# Altium project WM Mainboard.PrjPcb (part 1 of 2)
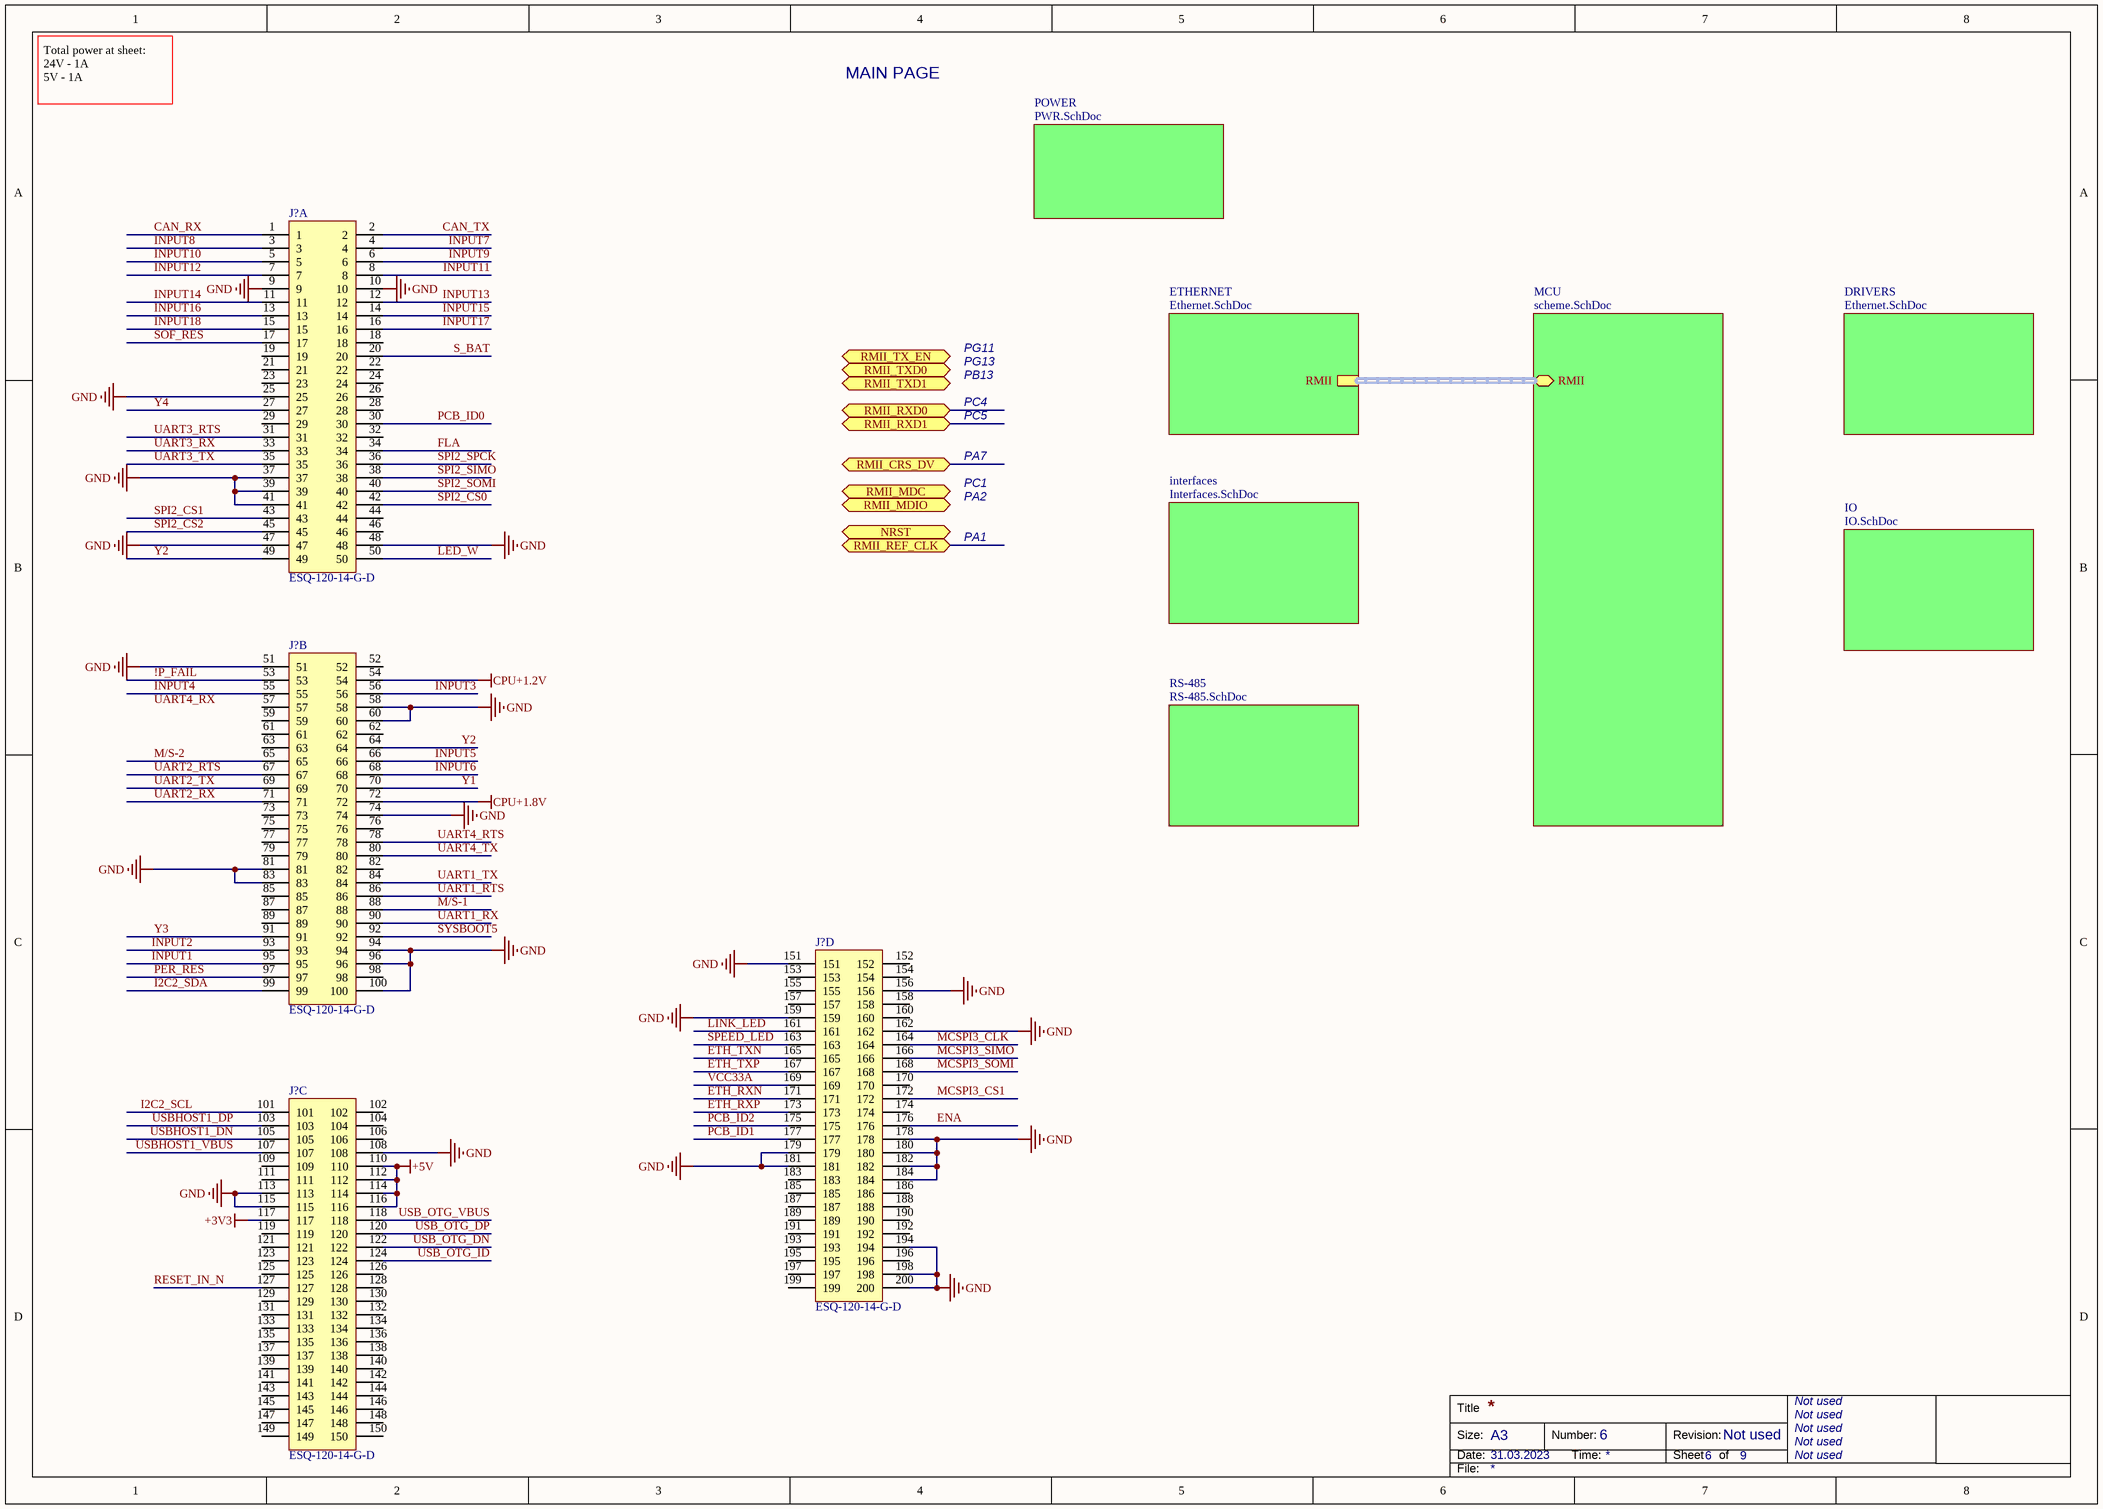
[diagram p0: WMM 05 Main Scheme.SchDoc]
CurrentDate: 31.03.2023; Project: Winding Machine Mainboard; Revision: 1.0; VersionRevision: 1.0
11 sheets, 177 parts. Net scope: hierarchical (ports join the sheet entries above them; power ports are global).
Board file: WMM Board.PcbDoc
Sheets:
  WMM 05 Main Scheme.SchDoc
    MCU = scheme.SchDoc
    IO = IO.SchDoc
      RELAYS = RELAYS.SchDoc
    POWER = PWR.SchDoc
    interfaces = Interfaces.SchDoc
    RS-485 = RS-485.SchDoc
  WMM 01 Cover Page.SchDoc
    Designator = WMM 02 Block Diagram.SchDoc
    Designator = WMM 02 Block Diagram.SchDoc
    Designator = WMM 03 PWR Diagram.SchDoc
    Designator = WMM 04 Insulation Diagram.SchDoc

## Sheet WMM 05 Main Scheme.SchDoc
size A3; Date: Not used; ApprovedBy: Not used; CheckedBy: Not used; Author: Not used; CompanyName: VR; DrawnBy: Not used; Engineer: Not used; Organization: Not used; Address1: Not used; Address2: Not used; Address3: Not used; Address4: Not used; DocumentNumber: 6; Revision: Not used; SheetNumber: 6; SheetTotal: 9; Time: Not used; ImagePath: Not used; Application_BuildNumber: Not used

### Parts
(Parts that share a designator on the sheet are numbered #1, #2 ... from top to bottom, then left to right.)
J?#1  ESQ-120-14-G-D  [SODIMM_200]  (part A of 4)
J?#2  ESQ-120-14-G-D  [SODIMM_200]  (part B of 4)
J?#3  ESQ-120-14-G-D  [SODIMM_200]  (part D of 4)
J?#4  ESQ-120-14-G-D  [SODIMM_200]  (part C of 4)

### Sub-sheets
DRIVERS = Ethernet.SchDoc (file not in this document): no entries
ETHERNET = Ethernet.SchDoc (file not in this document): RMII
interfaces = Interfaces.SchDoc: no entries
IO = IO.SchDoc: no entries
MCU = scheme.SchDoc: RMII (bidir)
POWER = PWR.SchDoc: no entries
RS-485 = RS-485.SchDoc: no entries

### Ports
NRST (bidir), RMII_CRS_DV (bidir), RMII_MDC (bidir), RMII_MDIO (bidir), RMII_REF_CLK (bidir), RMII_RXD0 (bidir), RMII_RXD1 (bidir), RMII_TX_EN (bidir), RMII_TXD0 (bidir), RMII_TXD1 (bidir)

### Nets
+3V3: J?#4.117
+5V: J?#4.110 J?#4.112 J?#4.114 J?#4.116
CPU+1.2V: J?#2.54
CPU+1.8V: J?#2.72
GND: J?#1.9 J?#1.10 J?#1.25 J?#1.37 J?#1.39 J?#1.41 J?#1.47 J?#1.48 J?#2.51 J?#2.58 J?#2.60 J?#2.74 J?#2.81 J?#2.83 J?#2.94 J?#2.96 J?#2.100 J?#3.151 J?#3.156 J?#3.159 J?#3.162 J?#3.178 J?#3.179 J?#3.180 J?#3.181 J?#3.182 J?#3.184 J?#3.194 J?#3.198 J?#3.200 J?#4.108 J?#4.113 J?#4.115
!P_FAIL: J?#2.53
CAN_RX: J?#1.1
CAN_TX: J?#1.2
ENA: J?#3.176
ETH_RXN: J?#3.171
ETH_RXP: J?#3.173
ETH_TXN: J?#3.165
ETH_TXP: J?#3.167
FLA: J?#1.34
I2C2_SCL: J?#4.101
I2C2_SDA: J?#2.99
INPUT1: J?#2.95
INPUT2: J?#2.93
INPUT3: J?#2.56
INPUT4: J?#2.55
INPUT5: J?#2.66
INPUT6: J?#2.68
INPUT7: J?#1.4
INPUT8: J?#1.3
INPUT9: J?#1.6
INPUT10: J?#1.5
INPUT11: J?#1.8
INPUT12: J?#1.7
INPUT13: J?#1.12
INPUT14: J?#1.11
INPUT15: J?#1.14
INPUT16: J?#1.13
INPUT17: J?#1.16
INPUT18: J?#1.15
LED_W: J?#1.50
LINK_LED: J?#3.161
M/S-1: J?#2.88
M/S-2: J?#2.65
MCSPI3_CLK: J?#3.164
MCSPI3_CS1: J?#3.172
MCSPI3_SIMO: J?#3.166
MCSPI3_SOMI: J?#3.168
PCB_ID0: J?#1.30
PCB_ID1: J?#3.177
PCB_ID2: J?#3.175
PER_RES: J?#2.97
RESET_IN_N: J?#4.127
S_BAT: J?#1.20
SOF_RES: J?#1.17
SPEED_LED: J?#3.163
SPI2_CS0: J?#1.42
SPI2_CS1: J?#1.43
SPI2_CS2: J?#1.45
SPI2_SIMO: J?#1.38
SPI2_SOMI: J?#1.40
SPI2_SPCK: J?#1.36
SYSBOOT5: J?#2.92
UART1_RTS: J?#2.86
UART1_RX: J?#2.90
UART1_TX: J?#2.84
UART2_RTS: J?#2.67
UART2_RX: J?#2.71
UART2_TX: J?#2.69
UART3_RTS: J?#1.31
UART3_RX: J?#1.33
UART3_TX: J?#1.35
UART4_RTS: J?#2.78
UART4_TX: J?#2.80
USB_OTG_DN: J?#4.122
USB_OTG_DP: J?#4.120
USB_OTG_ID: J?#4.124
USB_OTG_VBUS: J?#4.118
USBHOST1_DN: J?#4.105
USBHOST1_DP: J?#4.103
USBHOST1_VBUS: J?#4.107
VCC33A: J?#3.169
Y1: J?#2.70
Y2: J?#1.49 J?#2.64
Y3: J?#2.91
Y4: J?#1.27

Not connected (* = marked no-connect by the designer): J?#1 18 19 21 22 23 24 26 28 29 32 44 46; J?#2 52 57 59 61 62 63 73 75 76 77 79 82 85 87 89 98; J?#3 152 153 154 155 157 158 160 170 174 183 185 186 187 188 189 190 191 192 193 195 196 197 199; J?#4 102 104 106 109 111 119 121 123 125 126 128 129 130 131 132 133 134 135 136 137 138 139 140 141 142 143 144 145 146 147 148 149 150

### Buses and harness runs
harness sheet ETHERNET/RMII = sheet MCU/RMII

### Notes on the sheet
- Total power at sheet:
  24V - 1A
  5V - 1A
- MAIN PAGE
- PG11
- PG13
- PB13
- PC4
- PC5
- PA7
- PC1
- PA2
- PA1
- Labels drawn without touching a wire or pin: UART4_RX
- Title
- Size:
- Date:
- A3
- Number:
- Time:
- Revision:
- Sheet
- of
- File:

### Library data of the parts
J?#1-J?#4 = SODIMM-SOCKET: CONN RCPT 40POS .100" DUAL GOLD; Manufacturer: TE Connectivity; Manufacturer Part Number: 1717254-4; Connector Type: Receptacle; Number of Positions: 200; Number of Positions Loaded: All; Pitch: 0.100" (2.54mm); .Creator: MM; Supplier 1: Digi-Key; RoHS: RoHS Compliant; Category: Connectors, Interconnects; Stock 1: 51; Pricing 1: 1=7.42, 10=6.864, 50=6.1586, 100=5.7505, 250=5.00852, 500=4.823, 1000=4.6375, 2500=4.452 (USD); Packaging: Tape & Reel; Contact Type: Female Socket; Number of Rows: 2; Row Spacing: 0.100" (2.54mm); Mounting Type: Through Hole; Termination: Solder; Fastening Type: -; Features: -; Contact Finish: Gold; Contact Finish Thickness: 20µin (0.51µm); Color: Black; ComponentLink1URL: https://www.te.com/usa-en/product-1717254-4.html; ComponentLink1Description: DataSheet; Supplier Part Number 1: SAM8767-ND; .Checked PCB: MM; .Checked SCH: MM

## Sheet scheme.SchDoc: Driver Board For CNC
size A2; Author: veres; CompanyName: VR; DrawnBy: Vladimir; Engineer: Vladimir; Organization: Vladimir Tyrkin; Address1: veres.pcb@gmail.com; DocumentNumber: 001; Revision: 2.0; SheetNumber: 1; SheetTotal: 1
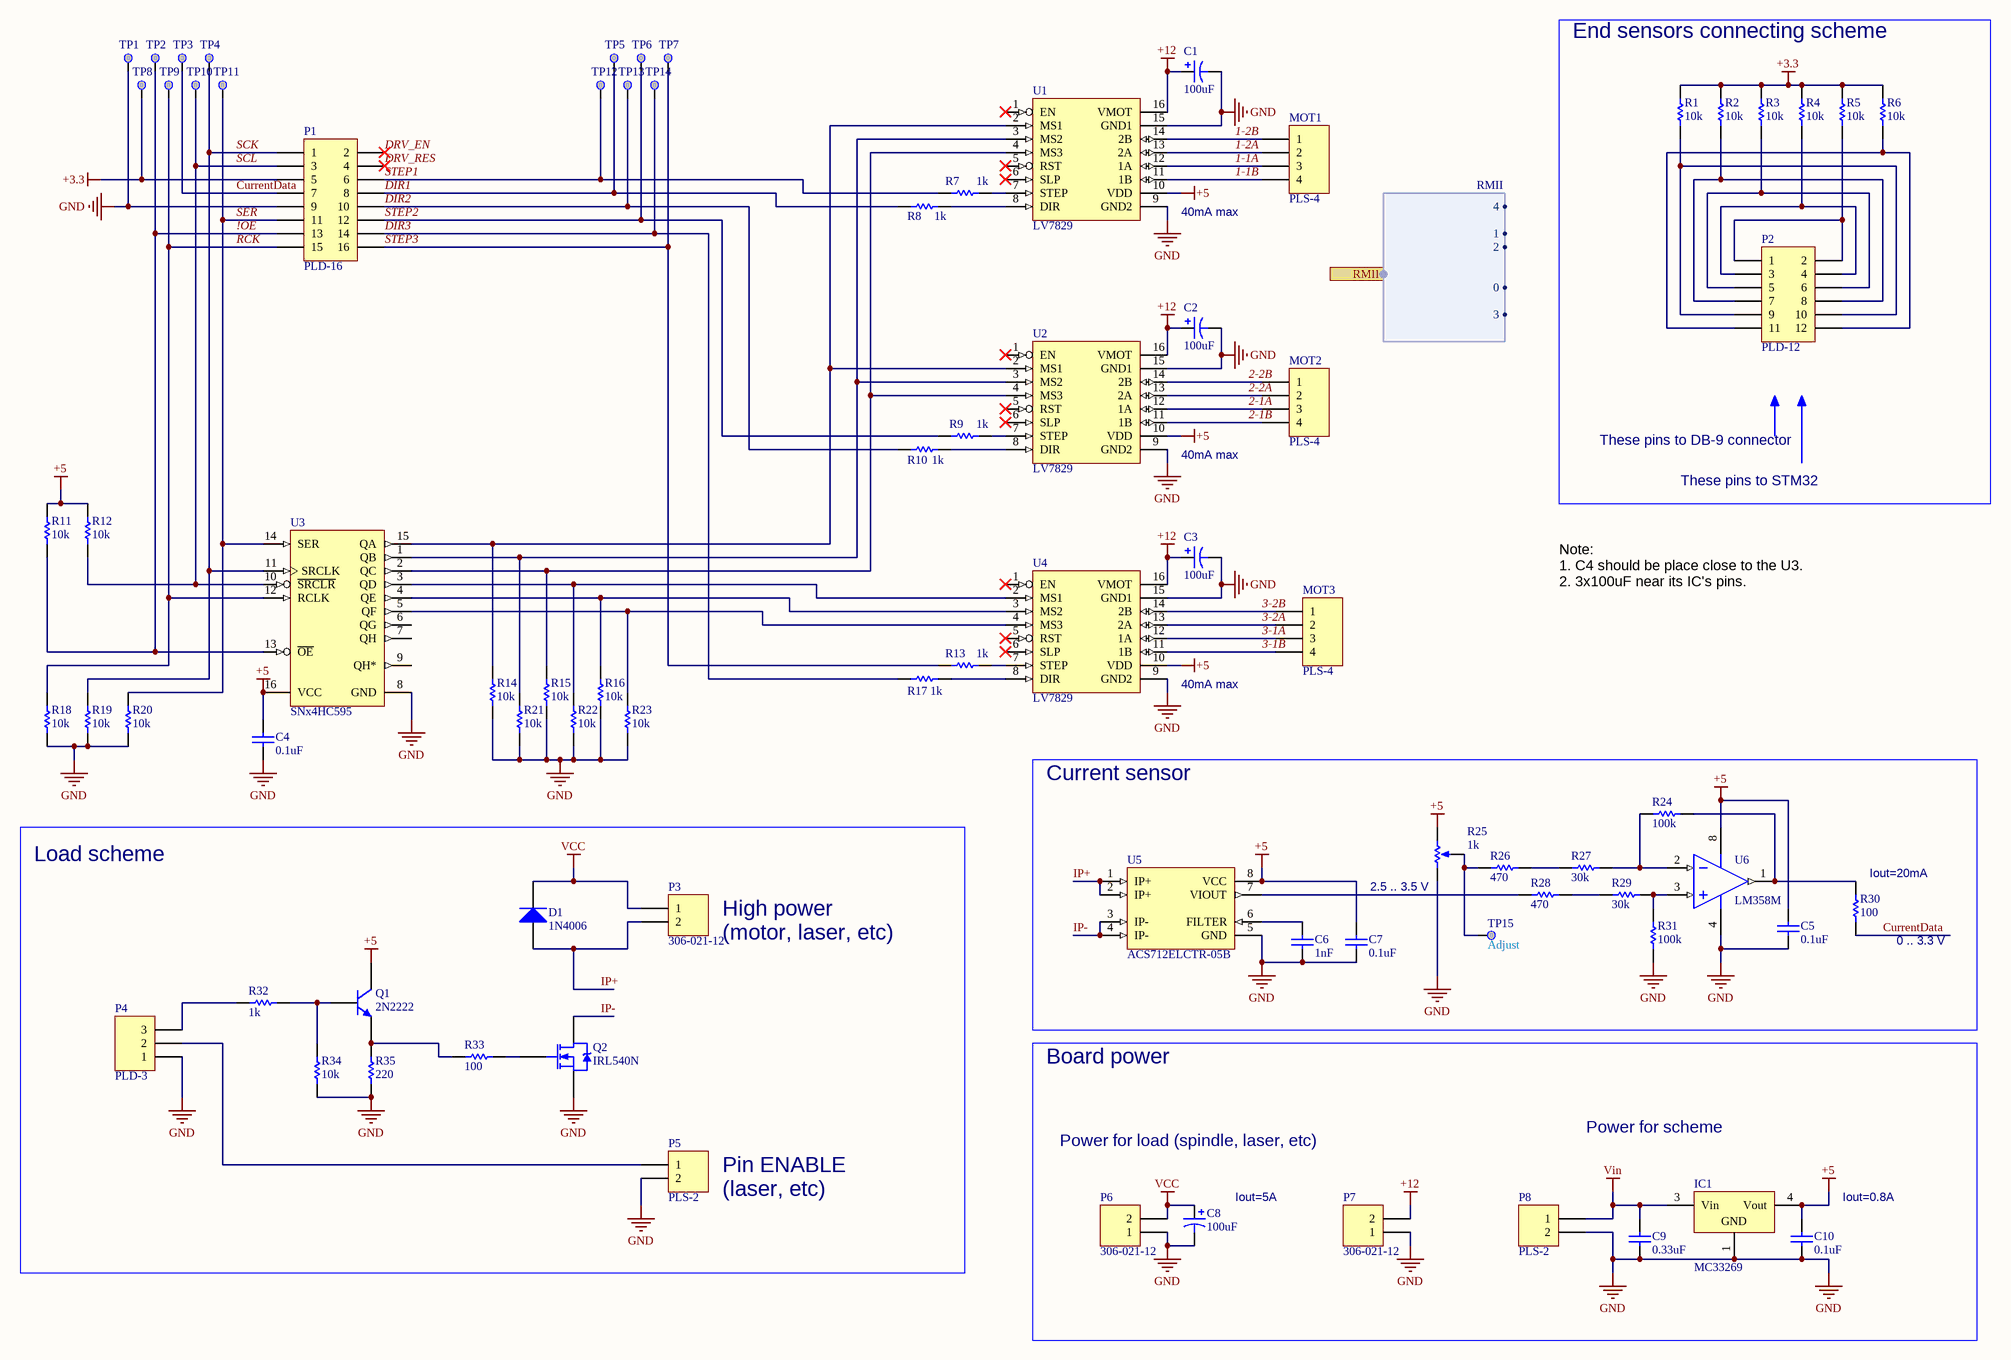
[diagram p1: scheme.SchDoc]

### Parts
C1  value 100uF  [UD-6,3X5,8_NICHICON]  (hidden comment: Cap Pol)
C2  value 100uF  [UD-6,3X5,8_NICHICON]  (hidden comment: Cap Pol)
C3  value 100uF  [UD-6,3X5,8_NICHICON]  (hidden comment: Cap Pol)
C4  value 0.1uF  [C1206]  (hidden comment: Cap)
C5  value 0.1uF  [C1206]  (hidden comment: Cap)
C6  value 1nF  [C0805]  (hidden comment: Cap)
C7  value 0.1uF  [C1206]  (hidden comment: Cap)
C8  value 100uF  [UD-6,3X5,8_NICHICON]  (hidden comment: Cap Pol)
C9  value 0.33uF  [C1206]  (hidden comment: Cap)
C10  value 0.1uF  [C1206]  (hidden comment: Cap)
D1  1N4006  [DO-41]
IC1  MC33269  [DPAK]
MOT1  PLS-4  [HDR1X4]
MOT2  PLS-4  [HDR1X4]
MOT3  PLS-4  [HDR1X4]
P1  PLD-16  [HDR2X8]
P2  PLD-12  [HDR2X6]
P3  306-021-12  [W237-102]
P4  PLD-3  [HDR1X3]
P5  PLS-2  [HDR1X2]
P6  306-021-12  [W237-102]
P7  306-021-12  [W237-102]
P8  PLS-2  [HDR1X2]
Q1  2N2222  [TO92]
Q2  IRL540N  [TO220BV]
R1  10k  [RES-0805]
R2  10k  [RES-0805]
R3  10k  [RES-0805]
R4  10k  [RES-0805]
R5  10k  [RES-0805]
R6  10k  [RES-0805]
R7  1k  [RES-0805]
R8  1k  [RES-0805]
R9  1k  [RES-0805]
R10  1k  [RES-0805]
R11  10k  [RES-0805]
R12  10k  [RES-0805]
R13  1k  [RES-0805]
R14  10k  [RES-0805]
R15  10k  [RES-0805]
R16  10k  [RES-0805]
R17  1k  [RES-0805]
R18  10k  [RES-0805]
R19  10k  [RES-0805]
R20  10k  [RES-0805]
R21  10k  [RES-0805]
R22  10k  [RES-0805]
R23  10k  [RES-0805]
R24  100k  [RES-0805]
R25  1k  [VR5]
R26  470  [RES-0805]
R27  30k  [RES-0805]
R28  470  [RES-1206]
R29  30k  [RES-0805]
R30  100  [RES-0805]
R31  100k  [RES-0805]
R32  1k  [RES-0805]
R33  100  [RES-0805]
R34  10k  [RES-0805]
R35  220  [RES-0805]
TP1  (no value)  [TP_SMD_1MM]  (no BOM)
TP2  (no value)  [TP_SMD_1MM]  (no BOM)
TP3  (no value)  [TP_SMD_1MM]  (no BOM)
TP4  (no value)  [TP_SMD_1MM]  (no BOM)
TP5  (no value)  [TP_SMD_1MM]  (no BOM)
TP6  (no value)  [TP_SMD_1MM]  (no BOM)
TP7  (no value)  [TP_SMD_1MM]  (no BOM)
TP8  (no value)  [TP_SMD_1MM]  (no BOM)
TP9  (no value)  [TP_SMD_1MM]  (no BOM)
TP10  (no value)  [TP_SMD_1MM]  (no BOM)
TP11  (no value)  [TP_SMD_1MM]  (no BOM)
TP12  (no value)  [TP_SMD_1MM]  (no BOM)
TP13  (no value)  [TP_SMD_1MM]  (no BOM)
TP14  (no value)  [TP_SMD_1MM]  (no BOM)
TP15  Adjust  [TestPoint]  (no BOM)
U1  LV7829  [LV8729_BREAKOUT]
U2  LV7829  [LV8729_BREAKOUT]
U3  SNx4HC595  [SO16]
U4  LV7829  [LV8729_BREAKOUT]
U5  value ACS712ELCTR-05B  [SO-8_L]  (hidden comment: Current Sensor)
U6  LM358M  [SO-8_L]

### Blocks framed on the sheet
End sensors connecting scheme: P2 R1-R6
Current sensor: C5-C7 R24-R31 TP15 U5 U6
Load scheme: D1 P3-P5 Q1 Q2 R32-R35
Board power: C8-C10 IC1 P6-P8

### Ports
RMII (harness RMII)

### Harnesses
RMII: 0, 1, 2, 3, 4

### Nets
+3.3: P1.5 R1.1 R2.1 R3.1 R4.1 R5.1 R6.1 TP8.1
+5: C4.2 C5.1 C7.2 C10.2 IC1.4(Vout) Q1.1(C) R11.1 R12.1 R25.3(BOT) U1.10(VDD) U2.10(VDD) U3.16(VCC) U4.10(VDD) U5.8(VCC) U6.8(V+)
+12: C1.1 C2.1 C3.1 P7.2 U1.16(VMOT) U2.16(VMOT) U4.16(VMOT)
GND: C1.2 C2.2 C3.2 C4.1 C5.2 C6.1 C7.1 C8.2 C9.1 C10.1 IC1.1(GND) P1.9 P4.1 P5.2 P6.1 P7.1 P8.2 Q2.3(S) R14.2 R15.2 R16.2 R18.2 R19.2 R20.2 R21.2 R22.2 R23.2 R25.1(TOP) R31.2 R34.2 R35.2 TP1.1 U1.9(GND2) U1.15(GND1) U2.9(GND2) U2.15(GND1) U3.8(GND) U4.9(GND2) U4.15(GND1) U5.5(GND) U6.4(V-)
VCC: C8.1 D1.2(K) P3.1 P6.2
Vin: C9.2 IC1.3(Vin) P8.1
1-1A: MOT1.3 U1.12(1A)
1-1B: MOT1.4 U1.11(1B)
1-2A: MOT1.2 U1.13(2A)
1-2B: MOT1.1 U1.14(2B)
2-1A: MOT2.3 U2.12(1A)
2-1B: MOT2.4 U2.11(1B)
2-2A: MOT2.2 U2.13(2A)
2-2B: MOT2.1 U2.14(2B)
3-1A: MOT3.3 U4.12(1A)
3-1B: MOT3.4 U4.11(1B)
3-2A: MOT3.2 U4.13(2A)
3-2B: MOT3.1 U4.14(2B)
!OE: P1.13 R11.2 TP2.1 U3.13(~{OE})
CurrentData: P1.7 R30.2 TP3.1
DIR1: P1.8 R8.2 TP5.1
DIR2: P1.10 R10.2 TP13.1
DIR3: P1.14 R17.2 TP14.1
DRV_EN: P1.2
DRV_RES: P1.4
IP+: D1.1(A) P3.2 U5.1(IP+) U5.2(IP+)
IP-: Q2.2(D) U5.3(IP-) U5.4(IP-)
RCK: P1.15 R18.1 TP9.1 U3.12(RCLK)
SCK: P1.1 R19.1 TP4.1 U3.11(SRCLK)
SCL: P1.3 R12.2 TP10.1 U3.10(~{SRCLR})
SER: P1.11 R20.1 TP11.1 U3.14(SER)
STEP1: P1.6 R7.2 TP12.1
STEP2: P1.12 R9.2 TP6.1
STEP3: P1.16 R13.2 TP7.1
NetC6_2: C6.2 U5.6(FILTER)
NetP2_1: P2.1 P2.2 R5.2
NetP2_3: P2.3 P2.4 R4.2
NetP2_5: P2.5 P2.6 R3.2
NetP2_7: P2.7 P2.8 R2.2
NetP2_9: P2.9 P2.10 R1.2
NetP2_11: P2.11 P2.12 R6.2
NetP4_2: P4.2 P5.1
NetP4_3: P4.3 R32.2
NetQ1_2: Q1.2(B) R32.1 R34.1
NetQ1_3: Q1.3(E) R33.2 R35.1
NetQ2_1: Q2.1(G) R33.1
NetR7_1: R7.1 U1.7(STEP)
NetR8_1: R8.1 U1.8(DIR)
NetR9_1: R9.1 U2.7(STEP)
NetR10_1: R10.1 U2.8(DIR)
NetR13_1: R13.1 U4.7(STEP)
NetR14_1: R14.1 U1.2(MS1) U2.2(MS1) U3.15(QA)
NetR15_1: R15.1 U1.4(MS3) U2.4(MS3) U3.2(QC)
NetR16_1: R16.1 U3.4(QE) U4.3(MS2)
NetR17_1: R17.1 U4.8(DIR)
NetR21_1: R21.1 U1.3(MS2) U2.3(MS2) U3.1(QB)
NetR22_1: R22.1 U3.3(QD) U4.2(MS1)
NetR23_1: R23.1 U3.5(QF) U4.4(MS3)
NetR24_1: R24.1 R27.1 U6.2(IN-)
NetR24_2: R24.2 R30.1 U6.1(OUT)
NetR25_2: R25.2(TAP) R26.1 TP15.1
NetR26_2: R26.2 R27.2
NetR28_1: R28.1 U5.7(VIOUT)
NetR28_2: R28.2 R29.2
NetR29_1: R29.1 R31.1 U6.3(IN+)

Not connected (* = marked no-connect by the designer): U1 1(EN)* 5(RST)* 6(SLP)*; U2 1(EN)* 5(RST)* 6(SLP)*; U3 6(QG) 7(QH) 9(QH*); U4 1(EN)* 5(RST)* 6(SLP)*

### Notes on the sheet
- (near U1) 40mA max
- (near U2) 40mA max
- These pins to DB-9 connector
- These pins to STM32
- (near U4) 40mA max
- Note:
  1. C4 should be place close to the U3.
  2. 3x100uF near its IC's pins.
- (near R25) 2.5 .. 3.5 V
- (near R30) Iout=20mA
- High power
  (motor, laser, etc)
- (near R30) 0 .. 3.3 V
- Power for load (spindle, laser, etc)
- Power for scheme
- Pin ENABLE
  (laser, etc)
- (near C8) Iout=5A
- Iout=0.8A
- Title
- Size:
- Date:
- File:
- A2
- Number:
- Time:
- Revision:
- Sheet
- of

### Library data of the parts
C1-C3 C8 = Cap Pol1: Polarized Capacitor (Radial) 16V, 105°C, 20% 6.3x5.4mm; Manufacturer: JB; Manufacturer_Part_Number: JCL1C101M063054; CHIPIDIP-code: 9000565735
C4 C5 C7 C10 = Cap: Capacitor ceramic SMD; Manufacturer: Murata; Manufacturer_Part_Number: GRM319R71H104K; CHIPIDIP-code: 348319975; Part_Type: Capacitor
C6 = Cap: Capacitor ceramic SMD; Manufacturer: HOLYSTONECAPS; Manufacturer_Part_Number: MLCC1000pFX7R50V10%0805; CHIPIDIP-code: 40582; Part_Type: Capacitor
C9 = Cap: Capacitor ceramic SMD; Manufacturer: Murata; Manufacturer_Part_Number: GRM319R71H334KA01D; CHIPIDIP-code: 344025606; Part_Type: Capacitor
D1 = Diode 1N4004: 1 Amp General Purpose Rectifier; Manufacturer: DC COMPONENTS CO., LTD.; Part_Type: Diode, Axial; CHIPIDIP-code: 3519; ComponentLink1Description: Manufacturer Link; ComponentLink1URL: http://www.fairchildsemi.com/; ComponentLink2Description: Datasheet; ComponentLink2URL: http://www.fairchildsemi.com/ds/1N%2F1N4001.pdf; Value: 1N4006; Manufacturer_Part_Number: 1N4006
IC1 = Volt Reg 5V: 5V Voltage Regulator; Manufacturer_Part_Number: MC33269DT−5.0; Manufacturer: ON Semiconductor; CHIPIDIP-code: 563066499; Value: MC33269; Part_Type: Voltage regulator
MOT1-MOT3 = Header 4: Header, 4-Pin; Manufacturer: Connfly; Manufacturer_Part_Number: DS1021-1*4SF11-B; Part_Type: Connector; CHIPIDIP-code: 174993133; Value2: (DS1021-1x4); Value: PLS-4
P1 = Header 8X2: Header, 8-Pin, Dual row; Manufacturer: Connfly; Manufacturer_Part_Number: DS1021-2*8SF11-B; Part_Type: Connector; CHIPIDIP-code: 4114; Value2: (DS1021-2x8); Value: PLD-16
P2 = Header 6X2: Header, 6-Pin, Dual row; Manufacturer: Connfly; Manufacturer_Part_Number: DS1021-2*6SF11-B; Part_Type: Connector; CHIPIDIP-code: none; Value2: DS1021-2x6; Value: PLD-12
P3 P6 P7 = Header 2: Screw connector, 2-Pin; Manufacturer: Ningbo Xinya M&E; Manufacturer_Part_Number: XY306A-5.0-2P-12; CHIPIDIP-code: 43112; Part_Type: Connector; Value: 306-021-12
P4 = Header 3: Header, 3-Pin; Manufacturer: Connfly; Manufacturer_Part_Number: DS1021-1*3SF11-B; Part_Type: Connector; CHIPIDIP-code: 132511368; Value2: (DS1021-1x3); Value: PLD-3
P5 P8 = Header 2: Header, 2-Pin; Manufacturer: Connfly; Manufacturer_Part_Number: DS1021-1*2SF11-B; Part_Type: Connector; CHIPIDIP-code: 260750144; Value2: (DS1021-1x2); Value: PLS-2
Q1 = NPN: NPN Bipolar Transistor; Manufacturer: ON Semiconductor; Manufacturer_Part_Number: KSP2222ABU; CHIPIDIP-code: 363567003; Value: 2N2222; Part_Type: Transistor
Q2 = NMOS-2: N-Channel Power MOSFET; Manufacturer: Infineon Technologies; Part_Type: Transistor; Manufacturer_Part_Number: IRL540NPBF; CHIPIDIP-code: 387859736; ComponentLink1Description: Manufacturer Link; ComponentLink1URL: http://www.irf.com/; Value: IRL540N
R1-R6 R11 R12 R14-R16 R18-R23 R34 = Res: Rectangular Thick Film Chip Resistor; Manufacturer_Part_Number: RC0805FR-0710KL; Manufacturer: Yageo; CHIPIDIP-code: 9000079514; Note: If flow soldering, adjust pad width of PCB Footprint to 0.7 - 0.8 times the width of the resistor.; Part_Type: Resistor; ComponentLink1Description: Manufacturer Link; ComponentLink1URL: http://www.panasonic.com/industrial/components/resistive_products.htm; ComponentLink2Description: Datasheet; ComponentLink2URL: http://www.panasonic.com/industrial/components/pdf/AOA0000CE8.pdf; Value: 10k
R7-R10 R13 R17 R32 = Res: Rectangular Thick Film Chip Resistor; Manufacturer: Yageo; Manufacturer_Part_Number: RC0805FR-071KL; CHIPIDIP-code: 9000079486; Note: If flow soldering, adjust pad width of PCB Footprint to 0.7 - 0.8 times the width of the resistor.; Part_Type: Resistor; ComponentLink1Description: Manufacturer Link; ComponentLink1URL: http://www.panasonic.com/industrial/components/resistive_products.htm; ComponentLink2Description: Datasheet; ComponentLink2URL: http://www.panasonic.com/industrial/components/pdf/AOA0000CE8.pdf; Value: 1k
R24 R31 = Res: Rectangular Thick Film Chip Resistor; Manufacturer_Part_Number: RC0805FR-07100KL; Manufacturer: Yageo; Note: If flow soldering, adjust pad width of PCB Footprint to 0.7 - 0.8 times the width of the resistor.; CHIPIDIP-code: 9000079538; ComponentLink1Description: Manufacturer Link; ComponentLink1URL: http://www.panasonic.com/industrial/components/resistive_products.htm; ComponentLink2Description: Datasheet; ComponentLink2URL: http://www.panasonic.com/industrial/components/pdf/AOA0000CE8.pdf; Value: 100k; Part_Type: Resistor
R25 = RPot: Potentiometer; Manufacturer_Part_Number: 3296W-1-102LF; Manufacturer: Bourns; CHIPIDIP-code: 4464; Set Position: 0.5; Part_Type: Potentiometer; Value: 1k
R26 = Res: Rectangular Thick Film Chip Resistor; Manufacturer_Part_Number: RC0805FR-07470RL; Manufacturer: Yageo; CHIPIDIP-code: 9000079478; Note: If flow soldering, adjust pad width of PCB Footprint to 0.7 - 0.8 times the width of the resistor.; Part_Type: Resistor; ComponentLink1Description: Manufacturer Link; ComponentLink1URL: http://www.panasonic.com/industrial/components/resistive_products.htm; ComponentLink2Description: Datasheet; ComponentLink2URL: http://www.panasonic.com/industrial/components/pdf/AOA0000CE8.pdf; Value: 470
R27 R29 = Res: Rectangular Thick Film Chip Resistor; Manufacturer_Part_Number: RC0805FR-0730KL; Manufacturer: Yageo; Note: If flow soldering, adjust pad width of PCB Footprint to 0.7 - 0.8 times the width of the resistor.; CHIPIDIP-code: 9000079525; ComponentLink1Description: Manufacturer Link; ComponentLink1URL: http://www.panasonic.com/industrial/components/resistive_products.htm; ComponentLink2Description: Datasheet; ComponentLink2URL: http://www.panasonic.com/industrial/components/pdf/AOA0000CE8.pdf; Value: 30k; Part_Type: Resistor
R28 = Res: Rectangular Thick Film Chip Resistor; Manufacturer_Part_Number: RC1206FR-07470RL; Manufacturer: Yageo; CHIPIDIP-code: 9000079907; Note: If flow soldering, adjust pad width of PCB Footprint to 0.7 - 0.8 times the width of the resistor.; Part_Type: Resistor; ComponentLink1Description: Manufacturer Link; ComponentLink1URL: http://www.panasonic.com/industrial/components/resistive_products.htm; ComponentLink2Description: Datasheet; ComponentLink2URL: http://www.panasonic.com/industrial/components/pdf/AOA0000CE8.pdf; Value: 470
R30 = Res: Rectangular Thick Film Chip Resistor; Manufacturer_Part_Number: RC0805FR-07100RL; Manufacturer: Yageo; Note: If flow soldering, adjust pad width of PCB Footprint to 0.7 - 0.8 times the width of the resistor.; CHIPIDIP-code: 9000079462; ComponentLink1Description: Manufacturer Link; ComponentLink1URL: http://www.panasonic.com/industrial/components/resistive_products.htm; ComponentLink2Description: Datasheet; ComponentLink2URL: http://www.panasonic.com/industrial/components/pdf/AOA0000CE8.pdf; Value: 100; Part_Type: Resistor
R33 = Res: Rectangular Thick Film Chip Resistor; Manufacturer_Part_Number: RC0805FR-07100RL; Manufacturer: Yageo; CHIPIDIP-code: 9000079462; Note: If flow soldering, adjust pad width of PCB Footprint to 0.7 - 0.8 times the width of the resistor.; Part_Type: Resistor; ComponentLink1Description: Manufacturer Link; ComponentLink1URL: http://www.panasonic.com/industrial/components/resistive_products.htm; ComponentLink2Description: Datasheet; ComponentLink2URL: http://www.panasonic.com/industrial/components/pdf/AOA0000CE8.pdf; Value: 100
R35 = Res: Rectangular Thick Film Chip Resistor; Manufacturer_Part_Number: RC0805FR-07220RL; Manufacturer: Yageo; CHIPIDIP-code: 9000079470; Note: If flow soldering, adjust pad width of PCB Footprint to 0.7 - 0.8 times the width of the resistor.; Part_Type: Resistor; ComponentLink1Description: Manufacturer Link; ComponentLink1URL: http://www.panasonic.com/industrial/components/resistive_products.htm; ComponentLink2Description: Datasheet; ComponentLink2URL: http://www.panasonic.com/industrial/components/pdf/AOA0000CE8.pdf; Value: 220
TP1-TP15 = Test Point: Part_Type: Mechanical; Status: Released; Manufacturer_Part_Number: n/a; Manufacturer: n/a; ComponentLink1Description: Datasheet; ComponentLink1URL: http://na
  TP15: Value: Adjust
U1 U2 U4 = LV7829: Stepper motor driver; Manufacturer_Part_Number: LV7829 Module; Manufacturer: China; CHIPIDIP-code: none; ComponentLink1Description: Datasheet; Part_Type: Driver; ComponentLink1URL: http://tunmcdsvn.tun.st.com/Component_Datasheet_Library/Trunk/Diodes/STM_ESD_ESDA6V1BC6; Value: LV7829; Component_Link: https://aliexpress.ru/item/32881945086.html?_ga=2.148448563.506267163.1640105170-654681520.1604340042&_gac=1.114864501.1639346332.Cj0KCQiA2NaNBhDvARIsAEw55hg0RpnmDiEVLwfBwV1DBwQRRzTZISLV43c0hEMg0tSMQHOqo776kiQaArGpEALw_wcB&sku_id=65626866361&spm=a2g39.orderlist.0.0.68c74aa6SGBVzg
  U1: ComponentLink: *
U3 = SNx4HC595: 8-bit shift register with 3-state output register; Manufacturer_Part_Number: SN74HC595D; Manufacturer: TI; CHIPIDIP-code: 37776; ComponentLink1Description: Datasheet; Part_Type: Shift register; ComponentLink1URL: http://tunmcdsvn.tun.st.com/Component_Datasheet_Library/Trunk/Diodes/STM_ESD_ESDA6V1BC6; Value: SNx4HC595
U5 = ACS712ELCTR-05B: Hall-Effect-Based Linear Current Sensor +-5A; Manufacturer: Allegro; CHIPIDIP-code: 9000043254; Manufacturer_Part_Number: ACS712ELCTR-05B; ComponentLink1Description: Datasheet; Part_Type: Sensor; ComponentLink1URL: http://tunmcdsvn.tun.st.com/Component_Datasheet_Library/Trunk/Diodes/STM_ESD_ESDA6V1BC6
U6 = Op Amp: FET Operational Amplifier; Manufacturer_Part_Number: LM358M/NOPB; Part_Type: OpAmp; Manufacturer: TI; CHIPIDIP-code: 39253; ComponentLink1Description: Manufacturer Link; ComponentLink1URL: http://www.analog.com/; Value: LM358M

## Sheet IO.SchDoc: Digital input and output
size A4; Date: Not used; ApprovedBy: Not used; CheckedBy: Not used; Author: Not used; CompanyName: STMicroelectronics; DrawnBy: Not used; Engineer: Not used; Organization: Not used; Address1: Not used; Address2: Not used; Address3: Not used; Address4: Not used; DocumentNumber: 6; Revision: Not used; SheetNumber: 6; SheetTotal: 9; Time: Not used; ImagePath: Not used; Application_BuildNumber: Not used
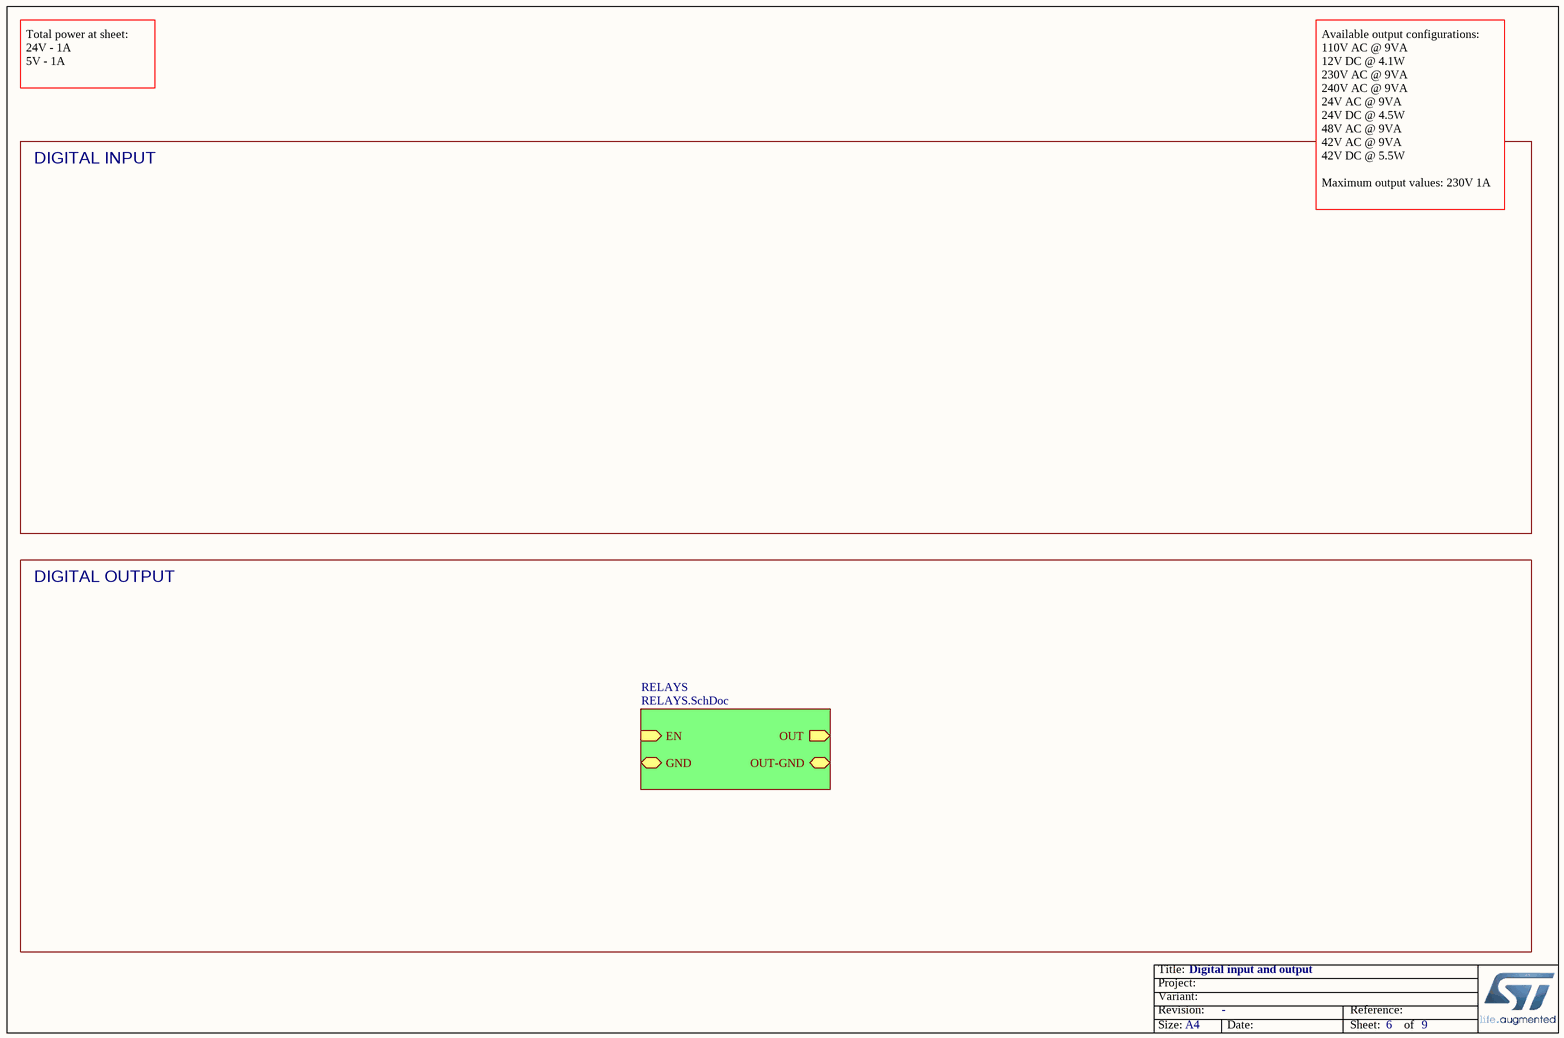
[diagram p2: IO.SchDoc]

### Sub-sheets
RELAYS = RELAYS.SchDoc: OUT (out), OUT-GND (bidir), EN (in), GND (bidir)

### Notes on the sheet
- Total power at sheet:
  24V - 1A
  5V - 1A
- DIGITAL INPUT
- Available output configurations:
  110V AC @ 9VA
  12V DC @ 4.1W
  230V AC @ 9VA
  240V AC @ 9VA
  24V AC @ 9VA
  24V DC @ 4.5W
  48V AC @ 9VA
  42V AC @ 9VA
  42V DC @ 5.5W
  Maximum output values: 230V 1A
- DIGITAL OUTPUT
- Title:
- Project:
- Size:
- Revision:
- Variant:
- A4
- -
- Date:
- Reference:
- Sheet:
- of

## Sheet RELAYS.SchDoc: Relays
size A4; Date: Not used; ApprovedBy: Not used; CheckedBy: Not used; Author: Not used; CompanyName: STMicroelectronics; DrawnBy: Not used; Engineer: Not used; Organization: Not used; Address1: Not used; Address2: Not used; Address3: Not used; Address4: Not used; DocumentNumber: 6; Revision: Not used; SheetNumber: 6; SheetTotal: 9; Time: Not used; ImagePath: Not used; Application_BuildNumber: Not used
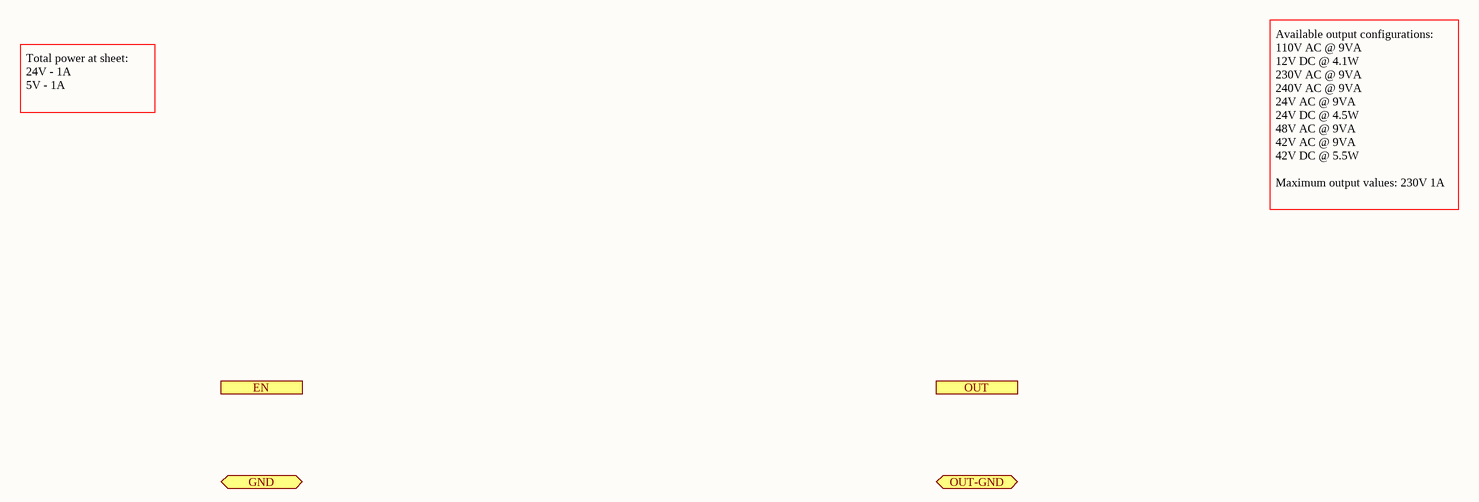
[diagram p3: RELAYS.SchDoc]

### Ports
EN (in), GND (bidir), OUT (out), OUT-GND (bidir)

### Notes on the sheet
- Total power at sheet:
  24V - 1A
  5V - 1A
- Available output configurations:
  110V AC @ 9VA
  12V DC @ 4.1W
  230V AC @ 9VA
  240V AC @ 9VA
  24V AC @ 9VA
  24V DC @ 4.5W
  48V AC @ 9VA
  42V AC @ 9VA
  42V DC @ 5.5W
  Maximum output values: 230V 1A
- Title
- Size:
- Date:
- A4
- Number:
- Time:
- Revision:
- Sheet
- of
- File:

## Sheet PWR.SchDoc
size A4; Organization: Altium Limited; Address1: L3, 12a Rodborough Rd; Address2: Frenchs Forest; Address3: NSW; Address4: Australia 2086
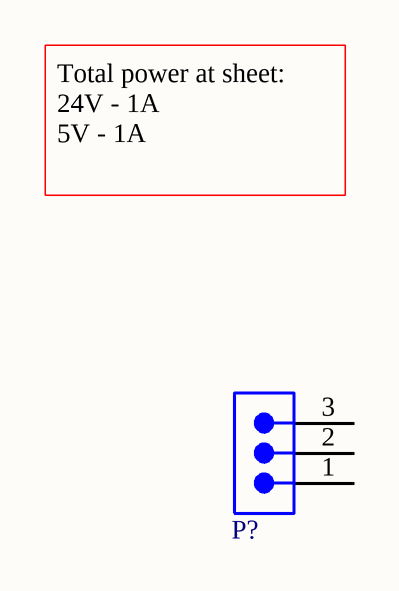
[diagram p4: PWR.SchDoc]

### Parts
P?  691313410003  [691313410003]  (value not drawn)

### Nets

Not connected (* = marked no-connect by the designer): P? 1 2 3

### Notes on the sheet
- Total power at sheet:
  24V - 1A
  5V - 1A
- Title
- Size:
- Date:
- A4
- Number:
- Time:
- Revision:
- Sheet
- of
- File:

### Library data of the parts
P? = 691313410003: WR-TBL Series 3134 Close Horizontal PCB Header, THT, pitch 7.62mm, 3p; Manufacturer: Wurth Elektronik; Modularity: No; Rated Current: 20A; Working Voltage: 300V; ComponentLink1Description: Website Link; ComponentLink1URL: https://www.we-online.com/redexpert/article/691313410003?ad; ComponentLink2Description: Datasheet Link; ComponentLink2URL: https://www.we-online.com/redexpert/spec/691313410003?ad; Manufacturer Part Number: 691313410003; Category: Terminal Blocks; Match Code: WR-TBL; Mount: Through Hole; Operating Temperature Max: 105°C; Operating Temperature Min: -40°C; Packaging: Box; Application: Pluggable; Number of Pins: 3; Number of Rows: 1; Orientation: Horizontal; Pitch: 7.62mm

## Sheet Interfaces.SchDoc: Ethernet PHY with RJ45 connector
size A2; Date: Not used; ApprovedBy: Not used; CheckedBy: Not used; Author: Not used; CompanyName: STMicroelectronics; DrawnBy: Not used; Engineer: Not used; Organization: Not used; Address1: Not used; Address2: Not used; Address3: Not used; Address4: Not used; DocumentNumber: 6; Revision: Not used; SheetNumber: 6; SheetTotal: 9; Time: Not used; ImagePath: Not used; Application_BuildNumber: Not used
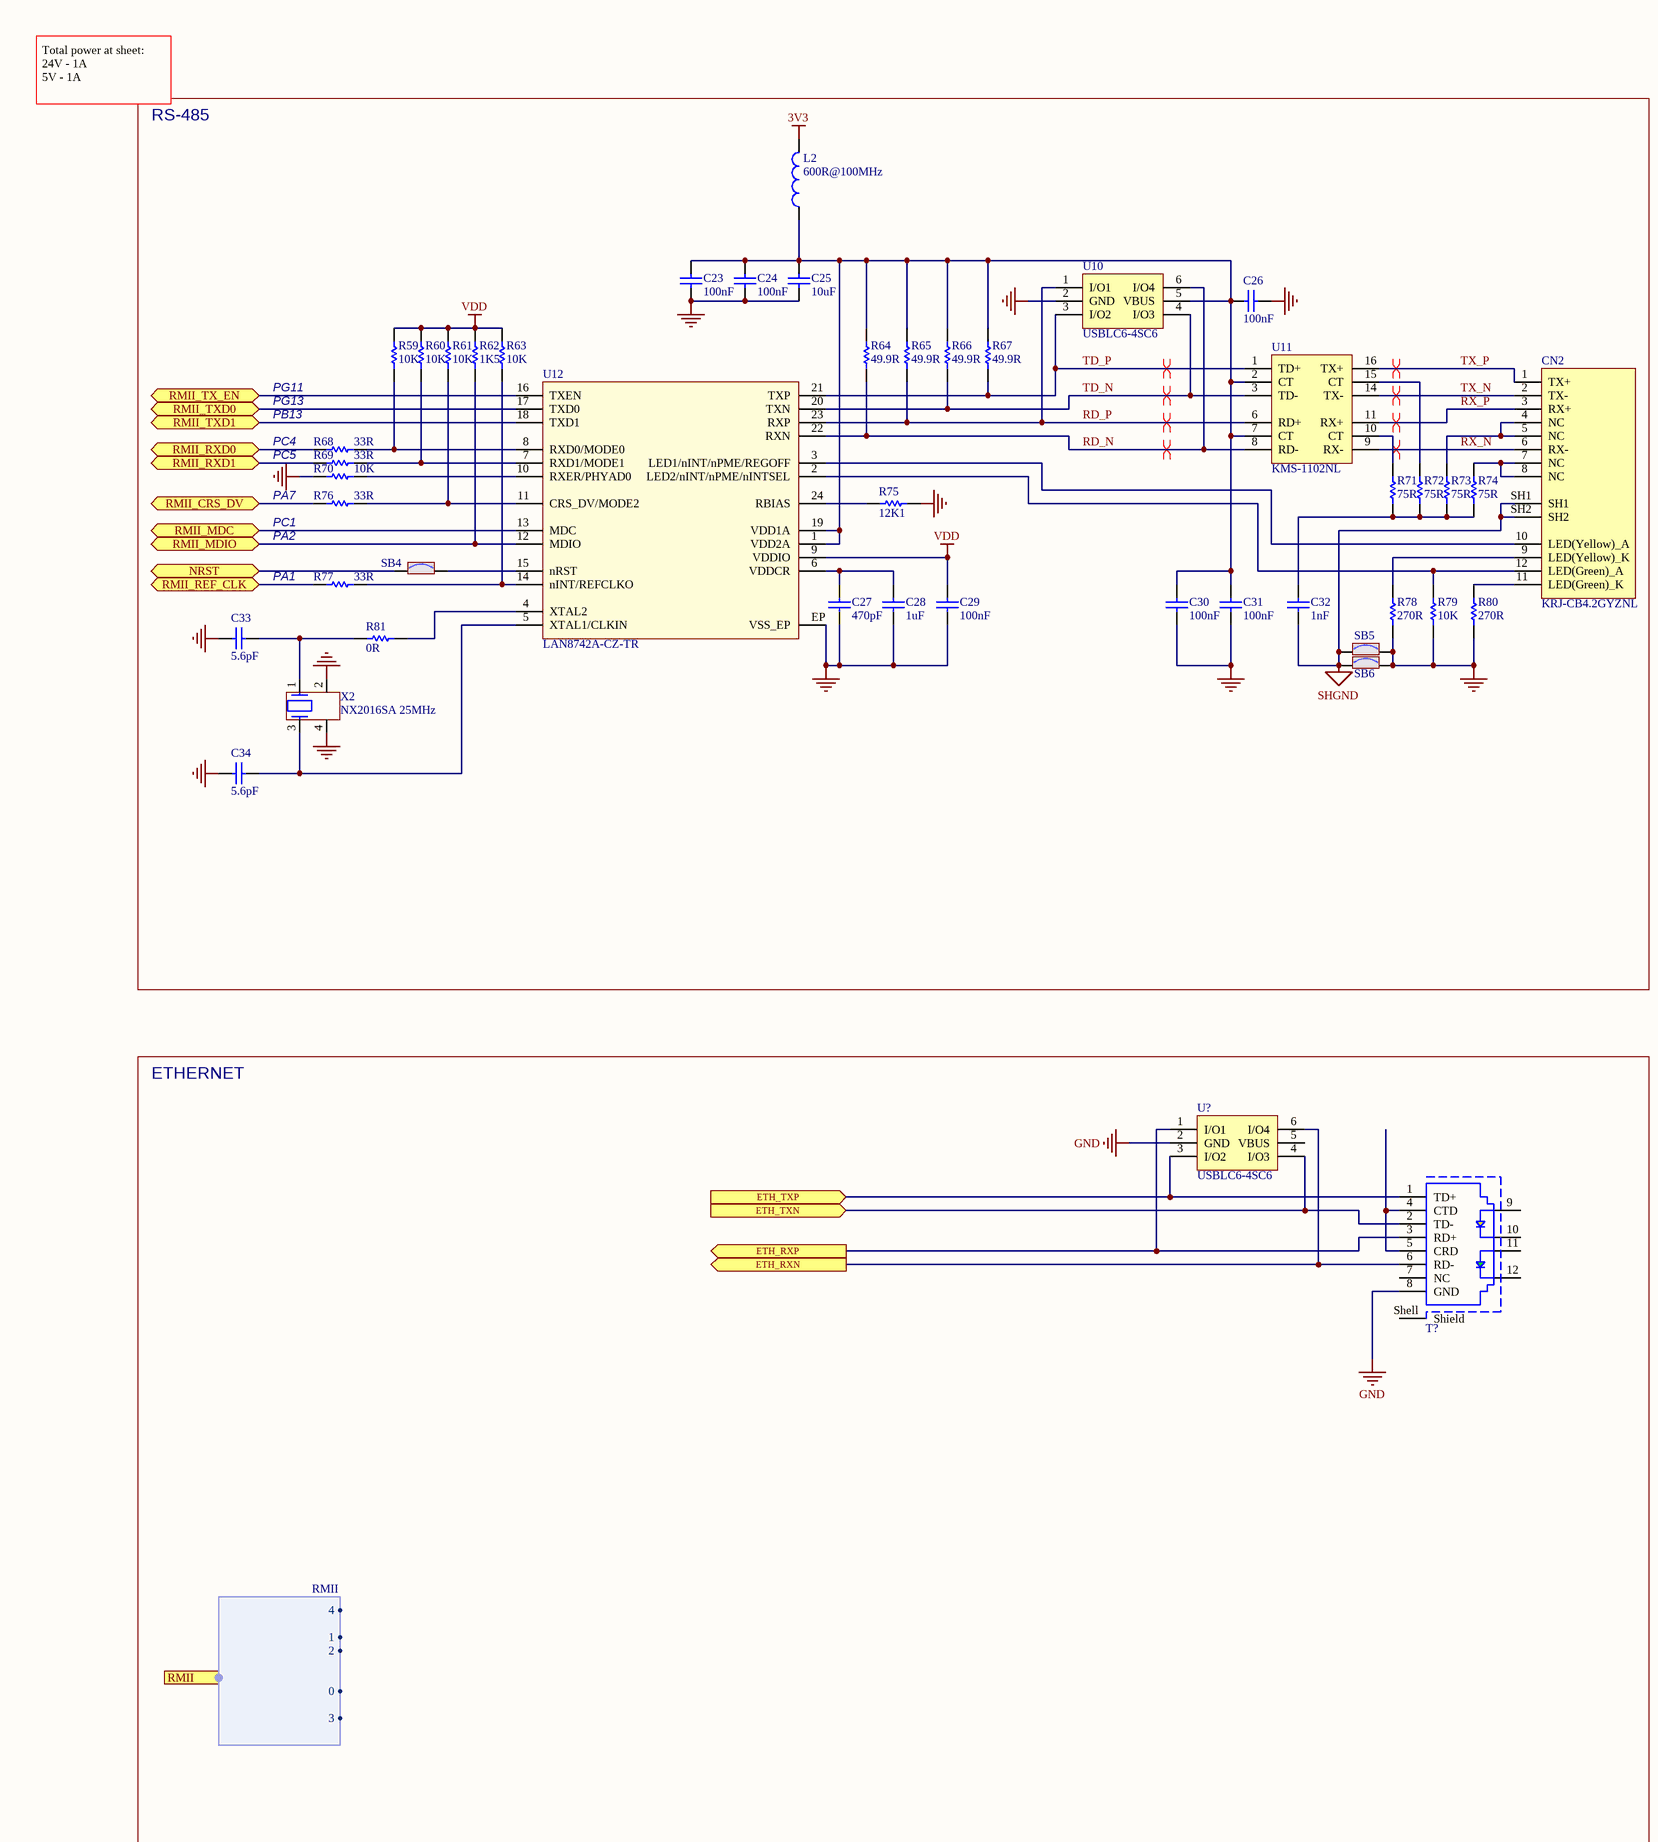
[diagram p5: Interfaces.SchDoc, left]
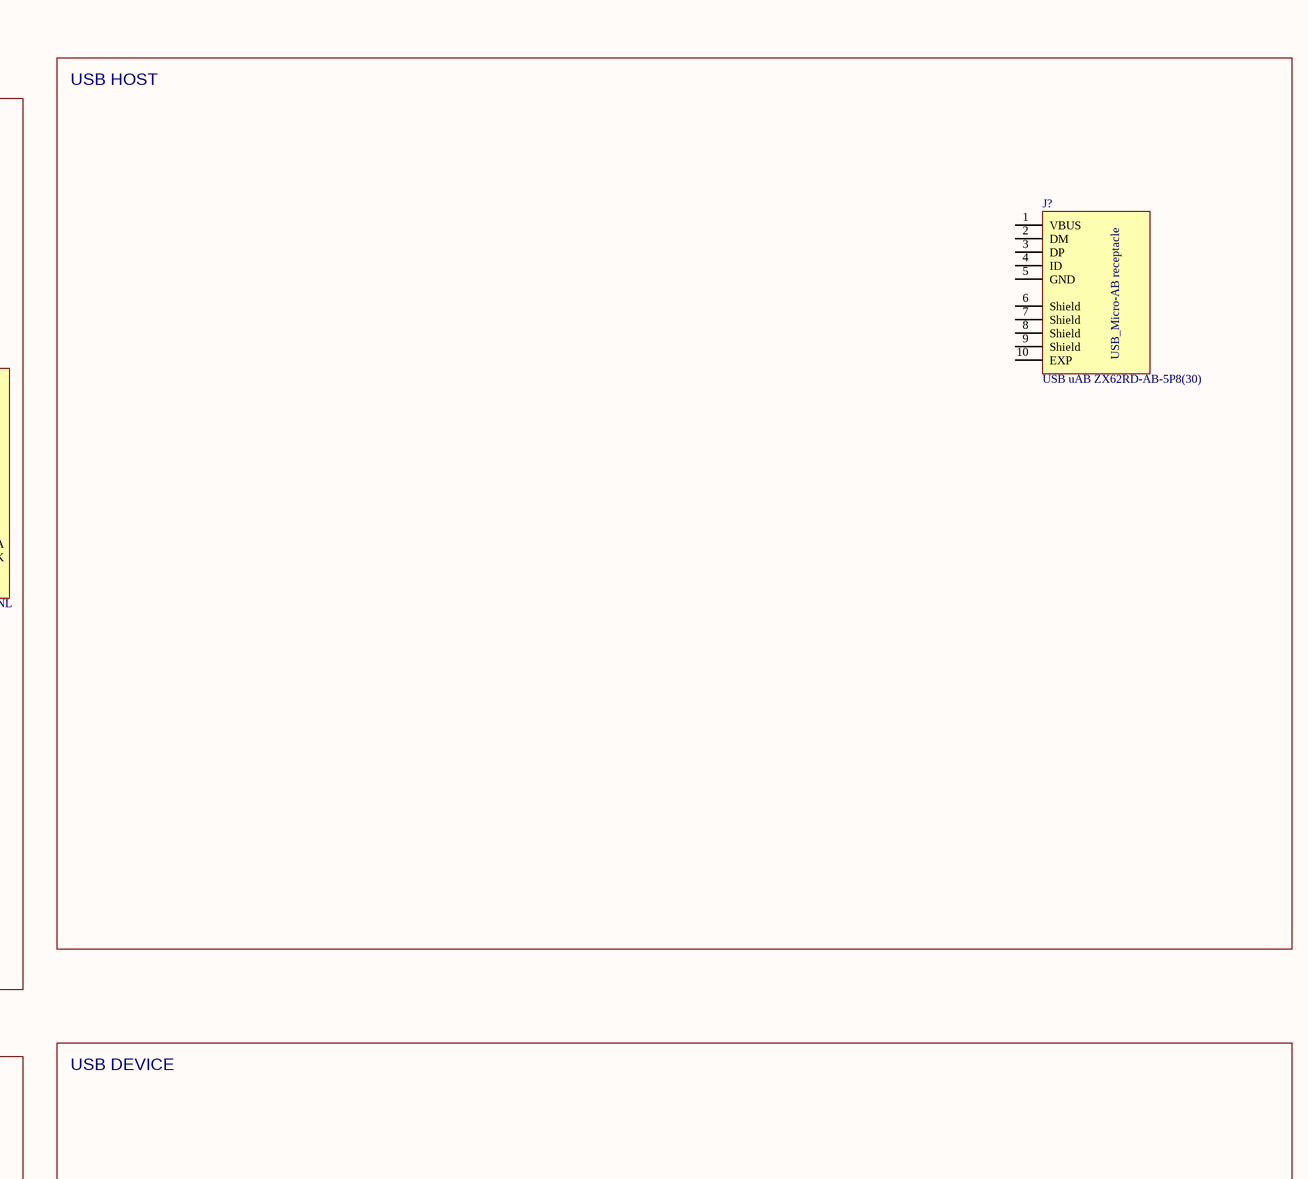
[diagram p6: Interfaces.SchDoc, right]

### Parts
(Parts that share a designator on the sheet are numbered #1, #2 ... from top to bottom, then left to right.)
C23  value 100nF  [C0603]  (hidden comment: Capacitor)
C24  value 100nF  [C0603]  (hidden comment: Capacitor)
C25  value 10uF  [C0603]  (hidden comment: Capacitor)
C26  value 100nF  [C0603]  (hidden comment: Capacitor)
C27  value 470pF  [C0402]  (hidden comment: Capacitor)
C28  value 1uF  [C0402]  (hidden comment: Capacitor)
C29  value 100nF  [C0603]  (hidden comment: Capacitor)
C30  value 100nF  [C0603]  (hidden comment: Capacitor)
C31  value 100nF  [C0603]  (hidden comment: Capacitor)
C32  value 1nF  [C1206_H1P6]  (hidden comment: Capacitor)
C33  value 5.6pF  [C0402]  (hidden comment: Capacitor)
C34  value 5.6pF  [C0402]  (hidden comment: Capacitor)
CN2  value KRJ-CB4.2GYZNL  [CON_RJ45_DGKYD_KRJ-CB4.2GYZNL]  (hidden comment: RJ45_KRJ-CB4.2GYZNL)
J?#5  value USB uAB ZX62RD-AB-5P8(30)  [CON_USBMICROAB_MOLEX_47590-0001_H3]  (hidden comment: USB_uAB_47590.0001)
L2  value 600R@100MHz  [L0603]  (hidden comment: BEAD)
R59#1  value 10K  [R0402]  (hidden comment: Resistor)
R60  value 10K  [R0402]  (hidden comment: Resistor)
R61  value 10K  [R0402]  (hidden comment: Resistor)
R62  value 1K5  [R0402]  (hidden comment: Resistor)
R63  value 10K  [R0402]  (hidden comment: Resistor)
R64  value 49.9R  [R0402]  (hidden comment: Resistor)
R65  value 49.9R  [R0402]  (hidden comment: Resistor)
R66  value 49.9R  [R0402]  (hidden comment: Resistor)
R67  value 49.9R  [R0402]  (hidden comment: Resistor)
R68  value 33R  [R0402]  (hidden comment: Resistor)
R69  value 33R  [R0402]  (hidden comment: Resistor)
R70  value 10K  [R0402]  (hidden comment: Resistor)
R71  value 75R  [R0402]  (hidden comment: Resistor)
R72  value 75R  [R0402]  (hidden comment: Resistor)
R73  value 75R  [R0402]  (hidden comment: Resistor)
R74  value 75R  [R0402]  (hidden comment: Resistor)
R75#1  value 12K1  [R0402]  (hidden comment: Resistor)
R76#1  value 33R  [R0402]  (hidden comment: Resistor)
R77#1  value 33R  [R0402]  (hidden comment: Resistor)
R78#1  value 270R  [R0402]  (hidden comment: Resistor)
R79  value 10K  [R0402]  (hidden comment: Resistor)
R80  value 270R  [R0402]  (hidden comment: Resistor)
R81  value 0R  [R0402]  (hidden comment: Resistor)
SB4  SB_ON  [SOLDER-BRIDGE_R0603-0R]  (value not drawn)
SB5  SB_ON  [SOLDER-BRIDGE_R0603-0R]  (value not drawn)
SB6  SB_ON  [SOLDER-BRIDGE_R0603-0R]  (value not drawn)
T?  74980111212  [74980111212]  (value not drawn)
U10  USBLC6-4SC6  [ESD_SOT23-6L]
U11  KMS-1102NL  [TRS_DGKYD_KMS-1102NL]
U12  LAN8742A-CZ-TR  [ICC_VQFN24-EPAD_4X4_P050]
U?  USBLC6-4SC6  [ESD_SOT23-6L]
X2  value NX2016SA 25MHz  [CRY_NX2016SA_4P]  (hidden comment: XTAL_4_PINS)

### Blocks framed on the sheet
USB HOST: J?#5
RS-485: C23-C34 CN2 L2 R59#1 R60-R74 R75#1 R76#1 R77#1 R78#1 R79-R81 SB4-SB6 U10-U12 X2
ETHERNET: T? U?

### Ports
ETH_RXN (out), ETH_RXP (out), ETH_TXN (in), ETH_TXP (in), NRST (bidir), RMII (harness RMII), RMII_CRS_DV (bidir), RMII_MDC (bidir), RMII_MDIO (bidir), RMII_REF_CLK (bidir), RMII_RXD0 (bidir), RMII_RXD1 (bidir), RMII_TX_EN (bidir), RMII_TXD0 (bidir), RMII_TXD1 (bidir)

### Harnesses
RMII: 0, 1, 2, 3, 4

### Nets
3V3: L2.2
GND: C23.1 C24.1 C25.1 C26.2 C27.1 C28.1 C29.1 C30.1 C31.1 C33.1 C34.1 R70.2 R75#1.2 R78#1.1 R79.1 R80.1 SB5.2 SB6.2 T?.8(GND) U10.2(GND) U12.EP(VSS_EP) U?.2(GND) X2.2 X2.4
SHGND: C32.1 CN2.SH1 CN2.SH2 SB5.1 SB6.1
VDD: C29.2 R59#1.2 R60.2 R61.2 R62.2 R63.2 U12.9(VDDIO)
RD_N: R64.1 U10.6(I/O4) U11.8(RD-) U12.22(RXN)
RD_P: R65.1 U10.1(I/O1) U11.6(RD+) U12.23(RXP)
RX_N: CN2.6(RX-) U11.9(RX-)
RX_P: CN2.3(RX+) U11.11(RX+)
TD_N: R66.1 U10.4(I/O3) U11.3(TD-) U12.20(TXN)
TD_P: R67.1 U10.3(I/O2) U11.1(TD+) U12.21(TXP)
TX_N: CN2.2(TX-) U11.14(TX-)
TX_P: CN2.1(TX+) U11.16(TX+)
NetC23_2: C23.2 C24.2 C25.2 C26.1 C30.2 C31.2 L2.1 R64.2 R65.2 R66.2 R67.2 U10.5(VBUS) U11.2(CT) U11.7(CT) U12.1(VDD2A) U12.19(VDD1A)
NetC27_2: C27.2 C28.2 U12.6(VDDCR)
NetC32_2: C32.2 R71.1 R72.1 R73.1 R74.1
NetC33_2: C33.2 R81.1 X2.1
NetC34_2: C34.2 U12.5(XTAL1/CLKIN) X2.3
NetCN2_4: CN2.4(NC) CN2.5(NC) R73.2
NetCN2_7: CN2.7(NC) CN2.8(NC) R74.2
NetCN2_9: CN2.9(LED(Yellow)_K) R78#1.2
NetCN2_10: CN2.10(LED(Yellow)_A) U12.3(LED1/nINT/nPME/REGOFF)
NetCN2_11: CN2.11(LED(Green)_K) R80.2
NetCN2_12: CN2.12(LED(Green)_A) R79.2 U12.2(LED2/nINT/nPME/nINTSEL)
NetR59#1_1: R59#1.1 R68.2 U12.8(RXD0/MODE0)
NetR60_1: R60.1 R69.2 U12.7(RXD1/MODE1)
NetR61_1: R61.1 R76#1.2 U12.11(CRS_DV/MODE2)
NetR62_1: R62.1 U12.12(MDIO) ; port RMII_MDIO
NetR63_1: R63.1 R77#1.2 U12.14(nINT/REFCLKO)
NetR68_1: R68.1 ; port RMII_RXD0
NetR69_1: R69.1 ; port RMII_RXD1
NetR70_1: R70.1 U12.10(RXER/PHYAD0)
NetR71_2: R71.2 U11.10(CT)
NetR72_2: R72.2 U11.15(CT)
NetR75#1_1: R75#1.1 U12.24(RBIAS)
NetR76#1_1: R76#1.1 ; port RMII_CRS_DV
NetR77#1_1: R77#1.1 ; port RMII_REF_CLK
NetR81_2: R81.2 U12.4(XTAL2)
NetSB4_1: SB4.1 ; port NRST
NetSB4_2: SB4.2 U12.15(nRST)
NetT?_1: T?.1(TD+) U?.3(I/O2) ; port ETH_TXP
NetT?_2: T?.2(TD-) U?.4(I/O3) ; port ETH_TXN
NetT?_3: T?.3(RD+) U?.1(I/O1) ; port ETH_RXP
NetT?_4: T?.4(CTD) T?.5(CRD)
NetT?_6: T?.6(RD-) U?.6(I/O4) ; port ETH_RXN
NetU12_13: U12.13(MDC) ; port RMII_MDC
NetU12_16: U12.16(TXEN) ; port RMII_TX_EN
NetU12_17: U12.17(TXD0) ; port RMII_TXD0
NetU12_18: U12.18(TXD1) ; port RMII_TXD1

Not connected (* = marked no-connect by the designer): J?#5 1(VBUS) 2(DM) 3(DP) 4(ID) 5(GND) 6(Shield) 7(Shield) 8(Shield) 9(Shield) 10(EXP); T? 7(NC) 9 10 11 12 Shell(Shield); U? 5(VBUS)

### Layout directives
differential pair: RD_N, RD_P, RX_N, RX_P, TD_N, TD_P, TX_N, TX_P

### Notes on the sheet
- Total power at sheet:
  24V - 1A
  5V - 1A
- PG11
- PG13
- PB13
- PC4
- PC5
- PA7
- PC1
- PA2
- (near R77#1) PA1
- USB DEVICE
- Title
- Size:
- Date:
- File:
- A2
- Number:
- Time:
- Revision:
- Sheet
- of
- (in symbol USB_uAB_47590.0001) USB_Micro-AB receptacle

### Library data of the parts
C23 C24 C26 C29-C31 = MCD-00237: Capacitor, MLCC, 100nF, 6V3, X5R, 10%, 0603, T=0,8mm; Manufacturer_Part_Number: CC0603KRX5R5BB104; Manufacturer: YAGEO; Provided_By: SUBCO; ECCN_US: EAR99; ECCN_EU: NEC; Internal_Part_Number: MCD-00237; Status: Released; Part_Type: Capacitor; Package: C0603; ComponentLink1Description: Datasheet; ComponentLink1URL: http://tunmcdsvn.tun.st.com/Component_Datasheet_Library/Trunk/Capacitors/Yageo_Multilayer_capacitor_X5R_series_100pF_to_100uF
C25 = MCD-01124: Capacitor, MLCC, 10µF, 10V, X5R, 10%, 0603, T=0.8mm; Manufacturer_Part_Number: GRM188R61A106KAAL; Manufacturer: MURATA; Provided_By: SUBCO; ECCN_US: EAR99; ECCN_EU: NEC; Internal_Part_Number: MCD-01124; Status: Released; Part_Type: Capacitor; Package: C0603; ComponentLink1Description: Datasheet; ComponentLink1URL: http://tunmcdsvn.tun.st.com/Component_Datasheet_Library/Trunk/Capacitors/Murata_Capacitor_GR_series
C27 = MCD-00724: Capacitor, MLCC, 470pF, 50V, NPO, 5%, 0402, T=0,5mm; Manufacturer_Part_Number: CC0402JRNPO9BN471; Manufacturer: YAGEO; Provided_By: SUBCO; Internal_Part_Number: MCD-00724; Status: Released; Part_Type: Capacitor; Package: C0402; ComponentLink1Description: Datasheet; ComponentLink1URL: http://tunmcdsvn.tun.st.com/Component_Datasheet_Library/Trunk/Capacitors/Yageo_Capacitor_NP0_16V-to-50V; ECCN_US: N/A; ECCN_EU: N/A
C28 = MCD-00095: Capacitor, MLCC, 1uF, 6V3, X5R, 10%, 0402, T=0,5mm; Manufacturer_Part_Number: GRM155R61E105KA12; Manufacturer: MURATA; Alternate_Manufacturer_Part_Number: GRM155R60J105KE19; Provided_By: SUBCO; ECCN_US: EAR99; ECCN_EU: NEC; Internal_Part_Number: MCD-00095; Status: Released; Part_Type: Capacitor; Package: C0402; ComponentLink1Description: Datasheet; ComponentLink1URL: http://tunmcdsvn.tun.st.com/Component_Datasheet_Library/Trunk/Capacitors/Murata_Capacitor_GR_series; Alternate_Manufacturer: MURATA
C32 = MCD-00722: Capacitor, MLCC, 1nF, 2KV, X7R, 10%, 1206, T=1,25mm; Manufacturer_Part_Number: CC1206KKX7RDBB102; Manufacturer: YAGEO; Provided_By: SUBCO; Internal_Part_Number: MCD-00722; Status: Released; Part_Type: Capacitor; Package: C1206; ComponentLink1Description: Datasheet; ComponentLink1URL: http://tunmcdsvn.tun.st.com/Component_Datasheet_Library/Trunk/Capacitors/Yageo_Multilayer_Capacitor_NPO_X7R_1KV_to_3KV_10pF_to_33nF/; ECCN_US: N/A; ECCN_EU: N/A
C33 C34 = MCD-01374: Capacitor, MLCC, 5.6pF, 50V, NPO, 5%, 0402, T=0,5mm; Manufacturer_Part_Number: CC0402BRNPO9BN5R6; Manufacturer: YAGEO; Provided_By: SUBCO; Internal_Part_Number: MCD-01374; Status: Released; Part_Type: Capacitor; Package: C0402; ComponentLink1Description: Datasheet; ComponentLink1URL: http://tunmcdsvn.tun.st.com/Component_Datasheet_Library/Trunk/Capacitors/Yageo_Capacitor_NP0_16V-to-50V; ECCN_US: N/A; ECCN_EU: N/A
CN2 = MCD-00717: RJ45 jack, single port, with LEDS, Metal shielded dip low profile; Part_Type: Connector; Manufacturer: DONGGUAN KEYOUDA ELECTRONIC TECHNOLOGY; Provided_By: SUBCO; Internal_Part_Number: MCD-00717; Status: Released; Manufacturer_Part_Number: KRJ-CB4.2GYZNL; ComponentLink1Description: Datasheet; ComponentLink1URL: http://tunmcdsvn.tun.st.com/Component_Datasheet_Library/Trunk/Connectors/DGKYD_RJ45_KRJ-CB4.2GYZNL; ECCN_US: n/a; ECCN_EU: n/a
J?#5 = USB_uAB_47590.0001: USB-MICRO-AB Receptacle, RA, SMT + DIP, Standard, Top Mount, USB certified (symbol & footprint compatible with MCD-00022); Internal_Part_Number: MCD-00661; Part_Type: Connector; Manufacturer_Part_Number: ZX62RD-AB-5P8(30); Manufacturer: HIROSE; Provided_By: SUBCO; Status: Checked; ComponentLink1Description: Datasheet; ComponentLink1URL: http://tunmcdsvn.tun.st.com/Component_Datasheet_Library/Trunk/Connectors/Hirose_ZX_catalog-939768; ECCN_US: n/a; ECCN_EU: n/a
L2 = MCD-00047: SMD Chip ferrite bead, 600R@100MHz +/-25%, 350mA, 500mohm DC, 0603, T=0.8mm; Part_Type: Inductor; Manufacturer_Part_Number: FCM1608KF-601T03; Manufacturer: TAI-TECH; Provided_By: SUBCO; Internal_Part_Number: MCD-00047; Status: Released; ComponentLink1Description: Datasheet; ComponentLink1URL: http://tunmcdsvn.tun.st.com/Component_Datasheet_Library/Trunk/Inductors/TaiTech_Bead_FCM1608_series; ECCN_US: n/a; ECCN_EU: n/a
R59#1 R60 R61 R63 R70 R79 = MCD-00053: Resistor,10K,0402,1%,1/16W; Manufacturer_Part_Number: RC0402FR-0710KL; Manufacturer: YAGEO; Provided_By: SUBCO; ECCN_US: EAR99; ECCN_EU: NEC; Internal_Part_Number: MCD-00053; Status: Released; Part_Type: Resistor; Package: R0402; ComponentLink1Description: Datasheet; ComponentLink1URL: http://tunmcdsvn.tun.st.com/Component_Datasheet_Library/Trunk/Resistors/Yageo_Resistor_RC0402-series
R62 = MCD-00068: Resistor,1K5,0402,1%,1/16W; Manufacturer_Part_Number: RC0402FR-071K5L; Manufacturer: YAGEO; Provided_By: SUBCO; ECCN_US: EAR99; ECCN_EU: NEC; Internal_Part_Number: MCD-00068; Status: Released; Part_Type: Resistor; Package: R0402; ComponentLink1Description: Datasheet; ComponentLink1URL: http://tunmcdsvn.tun.st.com/Component_Datasheet_Library/Trunk/Resistors/Yageo_Resistor_RC0402-series
R64-R67 = MCD-00565: Resistor,49R9,0402,1%,1/16W; Manufacturer_Part_Number: RC0402FR-0749R9L; Manufacturer: YAGEO; Provided_By: SUBCO; ECCN_US: EAR99; ECCN_EU: NEC; Internal_Part_Number: MCD-00565; Status: Released; Part_Type: Resistor; Package: R0402; ComponentLink1Description: Datasheet; ComponentLink1URL: http://tunmcdsvn.tun.st.com/Component_Datasheet_Library/Trunk/Resistors/Yageo_Resistor_RC0402-series
R68 R69 R76#1 R77#1 = MCD-00455: Resistor,33R,0402,1%,1/16W; Manufacturer_Part_Number: RC0402FR-0733RL; Manufacturer: YAGEO; Provided_By: SUBCO; ECCN_US: EAR99; ECCN_EU: NEC; Internal_Part_Number: MCD-00455; Status: Released; Part_Type: Resistor; Package: R0402; ComponentLink1Description: Datasheet; ComponentLink1URL: http://tunmcdsvn.tun.st.com/Component_Datasheet_Library/Trunk/Resistors/Yageo_Resistor_RC0402-series
R71-R74 = MCD-00515: Resistor,75R,0402,1%,1/16W; Manufacturer_Part_Number: RC0402FR-0775RL; Manufacturer: YAGEO; Provided_By: SUBCO; ECCN_US: EAR99; ECCN_EU: NEC; Internal_Part_Number: MCD-00515; Status: Released; Part_Type: Resistor; Package: R0402; ComponentLink1Description: Datasheet; ComponentLink1URL: http://tunmcdsvn.tun.st.com/Component_Datasheet_Library/Trunk/Resistors/Yageo_Resistor_RC0402-series
R75#1 = MCD-00723: Resistor,12K1,0402,1%,1/16W; Manufacturer_Part_Number: RC0402FR-0712K1L; Manufacturer: YAGEO; Provided_By: SUBCO; ECCN_US: EAR99; ECCN_EU: NEC; Internal_Part_Number: MCD-00723; Status: Released; Part_Type: Resistor; Package: R0402; ComponentLink1Description: Datasheet; ComponentLink1URL: http://tunmcdsvn.tun.st.com/Component_Datasheet_Library/Trunk/Resistors/Yageo_Resistor_RC0402-series
R78#1 R80 = MCD-00441: Resistor,270R,0402,1%,1/16W; Manufacturer_Part_Number: RC0402FR-07270RL; Manufacturer: YAGEO; Provided_By: SUBCO; ECCN_US: EAR99; ECCN_EU: NEC; Internal_Part_Number: MCD-00441; Status: Released; Part_Type: Resistor; Package: R0402; ComponentLink1Description: Datasheet; ComponentLink1URL: http://tunmcdsvn.tun.st.com/Component_Datasheet_Library/Trunk/Resistors/Yageo_Resistor_RC0402-series
R81 = MCD-00052: Resistor,0R,0402,5%,1/16W; Manufacturer_Part_Number: RC0402JR-070RL; Manufacturer: YAGEO; Provided_By: SUBCO; ECCN_US: EAR99; ECCN_EU: NEC; Internal_Part_Number: MCD-00052; Status: Released; Part_Type: Resistor; Package: R0402; ComponentLink1Description: Datasheet; ComponentLink1URL: http://tunmcdsvn.tun.st.com/Component_Datasheet_Library/Trunk/Resistors/Yageo_Resistor_RC0402-series
SB4-SB6 = MCD-00071: Solder Bridge ON; Part_Type: Mechanical; Manufacturer_Part_Number: RC0603JR-070RL; Manufacturer: YAGEO; Provided_By: SUBCO; Internal_Part_Number: MCD-00071; Status: Released; ComponentLink1Description: Datasheet; Package: SB0603; ComponentLink1URL: http://tunmcdsvn.tun.st.com/Component_Datasheet_Library/Trunk/Resistors/Yageo_Resistor_RC0603-series; ECCN_US: n/a; ECCN_EU: n/a
T? = 74980111212: WE-RJ45 LAN Through Hole Reflow, THR, 1 Port, 10/100 Base-T, Tab Down; Manufacturer: Wurth Elektronik; LED: yellow/green; Number of Ports: 1; PoE: non-PoE; Shield Tabs: Yes; USB: No USB; Manufacturer Part Number: 74980111212; Category: Filtered Connectors; Match Code: WE-RJ45 LAN; ComponentLink1Description: Website Link; ComponentLink1URL: https://www.we-online.com/redexpert/article/74980111212?ad; ComponentLink2Description: Datasheet Link; ComponentLink2URL: https://www.we-online.com/redexpert/spec/74980111212?ad; Mount: Through Hole Reflow; Operating Temperature Max: 85°C; Operating Temperature Min: -40°C; Packaging: Tape and Reel; Length: 21.25mm; Width: 15.9mm; Height: 13.5mm; Data Rate: 10/100 Base-T; Tab: Down
U10 U? = MCD-00250: Very low capacitance ESD protection , 4 lines; Part_Type: IC; Manufacturer: STMICROELECTRONICS; BMS_Part_Number: 9151001; Provided_By: SUBCO with ST control; ECCN_US: EAR99; ECCN_EU: NEC; Internal_Part_Number: MCD-00250; Value: USBLC6-4SC6; Status: Released; Manufacturer_Part_Number: USBLC6-4SC6; ComponentLink1Description: Datasheet; ComponentLink1URL: http://tunmcdsvn.tun.st.com/Component_Datasheet_Library/Trunk/Diodes/STM_ESD_USBLC6-4SC6
U11 = MCD-00718: Discrete Magnetic Transformer Module, 16 pins, SMT, 100 Base-TX; Part_Type: IC; Manufacturer: DONGGUAN KEYOUDA ELECTRONIC TECHNOLOGY; Provided_By: SUBCO; Internal_Part_Number: MCD-00718; Value: KMS-1102NL; Status: Released; Manufacturer_Part_Number: KMS-1102NL; ComponentLink1Description: Datasheet; ComponentLink1URL: http://tunmcdsvn.tun.st.com/Component_Datasheet_Library/Trunk/IC/DGKYD_KMS-1102NL; ECCN_US: n/a; ECCN_EU: n/a
U12 = MCD-00719: 10/100M RMII Ethernet transceiver; Part_Type: IC; Manufacturer: MICROCHIP; Provided_By: SUBCO; Internal_Part_Number: MCD-00719; Value: LAN8742A-CZ-TR; Status: Released; Manufacturer_Part_Number: LAN8742A-CZ-TR; ComponentLink1Description: Datasheet; ComponentLink1URL: http://tunmcdsvn.tun.st.com/Component_Datasheet_Library/Trunk/IC/MICROCHIP_LAN8742A_RMII_PHY; ECCN_US: n/a; ECCN_EU: n/a
X2 = MCD-01364: Crystal 25MHz, 6pF, +-20ppm, 80ohms max, SMD; Part_Type: Crystal_Osc; Manufacturer_Part_Number: NX2016SA 25MHz EXS00A-CS11321; Manufacturer: NDK; BMS_Part_Number: 9157044; Provided_By: SUBCO; ECCN_US: EAR99; ECCN_EU: NEC; Internal_Part_Number: MCD-01364; Status: Released; Package: NX2016SA; ComponentLink1Description: Datasheet; ComponentLink1URL: http://tunmcdsvn.tun.st.com/Component_Datasheet_Library/Trunk/Crystal_Osc/NDK_NX2016SA 25MHz EXS00A-CS11321 (EXS10B-28187); Order_Code_Digikey: 644-1367